# Altium schematic sheet ideal-diode.SchDoc
size A
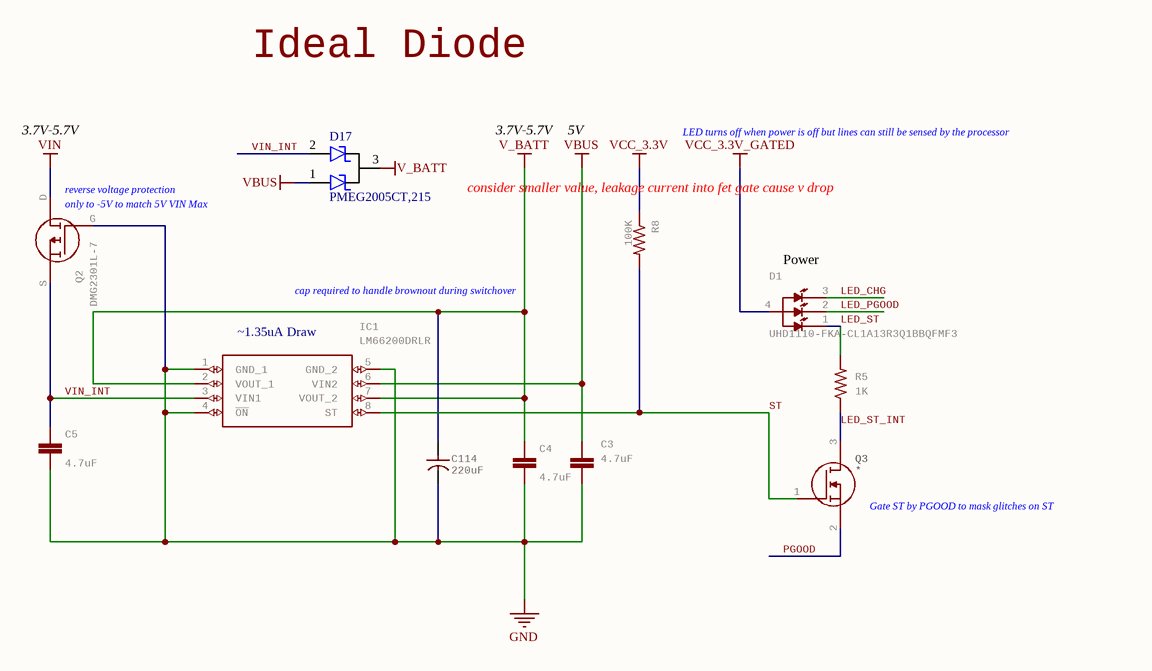
[diagram p0: ideal-diode.SchDoc]

## Parts
C3  4.7uF  [0402-CAP]
C4  4.7uF  [0402-CAP]
C5  4.7uF  [0402-CAP]
C114  220uF  [CAP-TANT-1411]
D1  UHD1110-FKA-CL1A13R3Q1BBQFMF3  [LED_UHD1110-FKA-CL1A13R3Q1BBQFMF3]
D17  MPN: PMEG2005CT,215  [SOT-23-3]  (hidden comment: Dual Schottky)
IC1  LM66200DRLR  [SOTFL50P160X60-8N]
Q2  DMG2301L-7  [SOT-23-3-FET]
Q3  NMOS  [DFN1006]  (value not drawn)
R5  1K  [r0201]
R8  100K  [r0201]

## Nets
GND: C3.1 C4.1 C5.1 C114.2 IC1.1(GND_1) IC1.4(~{ON}) IC1.5(GND_2) Q2.G
V_BATT: C4.2 C114.1 D17.3 IC1.2(VOUT_1) IC1.7(VOUT_2)
VBUS: C3.2 D17.1 IC1.6(VIN2)
VCC_3.3V: R8.1
VCC_3.3V_GATED: D1.4(ANODE)
VIN: Q2.D
LED_CHG: D1.3(RED)
LED_PGOOD: D1.2(GREEN)
LED_ST: D1.1(BLUE) R5.2
LED_ST_INT: Q3.3(D) R5.1
PGOOD: Q3.2(S)
ST: IC1.8(ST) Q3.1(G) R8.2
VIN_INT: C5.2 D17.2 IC1.3(VIN1) Q2.S

## Notes on the sheet
- Ideal Diode
- 3.7V-5.7V
- 5V
- LED turns off when power is off but lines can still be sensed by the processor
- (near Q2) reverse voltage protection
- (near Q2) only to -5V to match 5V VIN Max
- (near R8) consider smaller value, leakage current into fet gate cause v drop
- (near D1) Power
- (near IC1) ~1.35uA Draw
- cap required to handle brownout during switchover
- (near Q3) Gate ST by PGOOD to mask glitches on ST

## Library data of the parts
C3-C5 = CAP0402-CAP: CapacitorStandard 0603 ceramic capacitor, and 0.1" leaded capacitor.; MPN: JMK105BBJ475MV-F; GateName_1: G$1; SymbolName_1: CAP; DeviceName: 0402-CAP; LibraryName: sfe; DeviceSetName: CAP; Part Number: JMK105BBJ475MV-F
C114 = CAP_POL: MANUFACTURER P/N: F930J227MBA; Part Number: F930J227MBA; DISTRIBUTOR: *; DISTRIBUTOR P/N: *; Value: 220uF; Parameter 1: *; MPN: F930J227MBA
D1 = UHD1110-FKA-CL1A13R3Q1BBQFMF3: LED RGB SMD, SIZE 1 X 1 mm Check availability; GateName_1: G$1; MF: Cree Inc.; SymbolName_1: UHD1110-FKA-CL1A13R3Q1BBQFMF3; LibraryName: UHD1110-FKA-CL1A13R3Q1BBQFMF3; DeviceSetName: UHD1110-FKA-CL1A13R3Q1BBQFMF3; AVAILABILITY: In Stock; MP: UHD1110-FKA-CL1A13R3Q1BBQFMF3; MPN: UHD1110-FKA-CL1A13r3q1BBQFMF3; PACKAGE: 0404 Cree Inc.; PRICE: None; PURCHASE-URL: https://pricing.snapeda.com/search/part/UHD1110-FKA-CL1A13R3Q1BBQFMF3/?ref=eda; Part Number: UHD1110-FKA-CL1A13r3q1BBQFMF3
D17 = Dual Schottky: MANUFACTURER: Nexperia; Value: ?V; Part Number: PMEG2005CT,215
IC1 = LM66200DRLR: 1.6-V to 5.5-V, 40-m, 2.5-A, low-IQ, dual ideal diode   Source:  Datasheet; MANUFACTURER_NAME: Texas Instruments; GateName_1: G$1; SymbolName_1: LM66200DRLR; LibraryName: LM66200DRLR; DeviceSetName: LM66200DRLR; HEIGHT: 0.6mm; MANUFACTURER_PART_NUMBER: LM66200DRLR; MOUSER_PART_NUMBER: 595-LM66200DRLR; MOUSER_PRICE-STOCK: https://www.mouser.co.uk/ProductDetail/Texas-Instruments/LM66200DRLR?qs=Rp5uXu7WBW90hnpZAkIOdQ%3D%3D; MPN: LM66200DRLR; Part Number: LM66200DRLR
Q2 = DMG2301L-7: GateName_1: G$1; HEIGHT: 1.1mm; MPN: DMG2301L-7; Part Number: DMG2301L-7
R5 = RESISTOR0402-RES: ResistorBasic schematic elements and footprints for 0603, 1206, and PTH resistors.; GateName_1: G$1; SymbolName_1: RESISTOR; LibraryName: sfe; DeviceSetName: RESISTOR
R8 = RESISTOR0402-RES: GateName_1: G$1; SymbolName_1: RESISTOR; LibraryName: sfe; DeviceSetName: RESISTOR
Q3 = NMOS: MPN: *